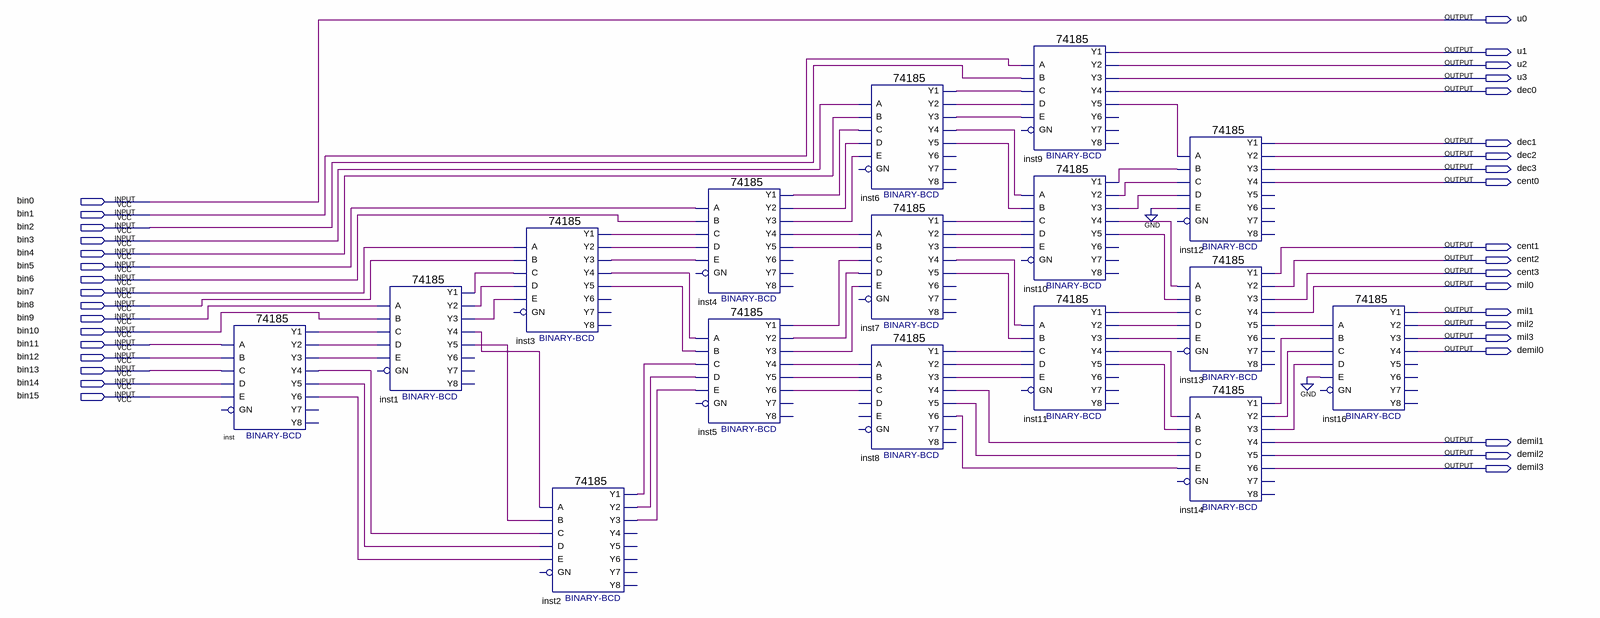
[diagram p0: schematic sheet]
// Quartus schematic BINARY2BCD.bdf as structural Verilog: 16 symbols, 36 pins
module BINARY2BCD (
  input  bin0,
  input  bin1,
  input  bin2,
  input  bin3,
  input  bin4,
  input  bin5,
  input  bin6,
  input  bin7,
  input  bin8,
  input  bin9,
  input  bin10,
  input  bin11,
  input  bin12,
  input  bin13,
  input  bin14,
  input  bin15,
  output u0,
  output u1,
  output u2,
  output u3,
  output dec0,
  output dec1,
  output dec2,
  output dec3,
  output cent0,
  output cent1,
  output cent2,
  output cent3,
  output mil0,
  output mil1,
  output mil2,
  output mil3,
  output demil0,
  output demil1,
  output demil2,
  output demil3
);

  wire inst1_y1, inst1_y2, inst1_y3, inst1_y4, inst1_y5, inst2_y1, inst2_y2, inst2_y3, inst3_y1, inst3_y2,
       inst3_y3, inst3_y4, inst3_y5, inst4_y1, inst4_y2, inst4_y3, inst4_y4, inst4_y5, inst5_y1, inst5_y2,
       inst5_y3, inst5_y4, inst5_y5, inst5_y6, inst6_y1, inst6_y2, inst6_y3, inst6_y4, inst6_y5, inst7_y1,
       inst7_y2, inst7_y3, inst7_y4, inst7_y5, inst8_y1, inst8_y2, inst8_y3, inst8_y4, inst8_y5, inst8_y6,
       inst9_y5, inst10_y1, inst10_y2, inst10_y3, inst10_y4, inst10_y5, inst11_y1, inst11_y2, inst11_y3,
       inst11_y4, inst11_y5, inst13_y5, inst14_y1, inst14_y2, inst14_y3, inst_y1, inst_y2, inst_y3, inst_y4,
       inst_y5, inst_y6;

  \74185  inst (
    .A(bin11), .B(bin12), .D(bin14), .C(bin13), .E(bin15), .Y1(inst_y1), .Y3(inst_y3), .Y2(inst_y2),
    .Y5(inst_y5), .Y4(inst_y4), .Y6(inst_y6));  // open: GN, Y8, Y7
  \74185  inst1 (
    .A(bin9), .B(bin10), .D(inst_y2), .C(inst_y1), .E(inst_y3), .Y1(inst1_y1), .Y3(inst1_y3), .Y2(inst1_y2),
    .Y5(inst1_y5), .Y4(inst1_y4));  // open: GN, Y6, Y8, Y7
  \74185  inst3 (
    .A(bin7), .B(bin8), .D(inst1_y2), .C(inst1_y1), .E(inst1_y3), .Y1(inst3_y1), .Y3(inst3_y3),
    .Y2(inst3_y2), .Y5(inst3_y5), .Y4(inst3_y4));  // open: GN, Y6, Y8, Y7
  \74185  inst2 (
    .A(inst1_y4), .B(inst1_y5), .D(inst_y5), .C(inst_y4), .E(inst_y6), .Y1(inst2_y1), .Y3(inst2_y3),
    .Y2(inst2_y2));  // open: GN, Y5, Y4, Y6, Y8, Y7
  \74185  inst4 (
    .A(bin5), .B(bin6), .D(inst3_y2), .C(inst3_y1), .E(inst3_y3), .Y1(inst4_y1), .Y3(inst4_y3),
    .Y2(inst4_y2), .Y5(inst4_y5), .Y4(inst4_y4));  // open: GN, Y6, Y8, Y7
  \74185  inst5 (
    .A(inst3_y4), .B(inst3_y5), .D(inst2_y2), .C(inst2_y1), .E(inst2_y3), .Y1(inst5_y1), .Y3(inst5_y3),
    .Y2(inst5_y2), .Y5(inst5_y5), .Y4(inst5_y4), .Y6(inst5_y6));  // open: GN, Y8, Y7
  \74185  inst6 (
    .A(bin3), .B(bin4), .D(inst4_y2), .C(inst4_y1), .E(inst4_y3), .Y1(inst6_y1), .Y3(inst6_y3),
    .Y2(inst6_y2), .Y5(inst6_y5), .Y4(inst6_y4));  // open: GN, Y6, Y8, Y7
  \74185  inst7 (
    .A(inst4_y4), .B(inst4_y5), .D(inst5_y2), .C(inst5_y1), .E(inst5_y3), .Y1(inst7_y1), .Y3(inst7_y3),
    .Y2(inst7_y2), .Y5(inst7_y5), .Y4(inst7_y4));  // open: GN, Y6, Y8, Y7
  \74185  inst8 (
    .A(inst5_y4), .B(inst5_y5), .C(inst5_y6), .Y1(inst8_y1), .Y3(inst8_y3), .Y2(inst8_y2), .Y5(inst8_y5),
    .Y4(inst8_y4), .Y6(inst8_y6));  // open: D, E, GN, Y8, Y7
  \74185  inst9 (
    .A(bin1), .B(bin2), .D(inst6_y2), .C(inst6_y1), .E(inst6_y3), .Y1(u1), .Y3(u3), .Y2(u2), .Y5(inst9_y5),
    .Y4(dec0));  // open: GN, Y6, Y8, Y7
  \74185  inst10 (
    .A(inst6_y4), .B(inst6_y5), .D(inst7_y2), .C(inst7_y1), .E(inst7_y3), .Y1(inst10_y1), .Y3(inst10_y3),
    .Y2(inst10_y2), .Y5(inst10_y5), .Y4(inst10_y4));  // open: GN, Y6, Y8, Y7
  \74185  inst11 (
    .A(inst7_y4), .B(inst7_y5), .D(inst8_y2), .C(inst8_y1), .E(inst8_y3), .Y1(inst11_y1), .Y3(inst11_y3),
    .Y2(inst11_y2), .Y5(inst11_y5), .Y4(inst11_y4));  // open: GN, Y6, Y8, Y7
  \74185  inst12 (
    .A(inst9_y5), .B(inst10_y1), .D(inst10_y3), .C(inst10_y2), .E(1'b0), .Y1(dec1), .Y3(dec3), .Y2(dec2),
    .Y4(cent0));  // open: GN, Y5, Y6, Y8, Y7
  \74185  inst13 (
    .A(inst10_y4), .B(inst10_y5), .D(inst11_y2), .C(inst11_y1), .E(inst11_y3), .Y1(cent1), .Y3(cent3),
    .Y2(cent2), .Y5(inst13_y5), .Y4(mil0));  // open: GN, Y6, Y8, Y7
  \74185  inst14 (
    .A(inst11_y4), .B(inst11_y5), .D(inst8_y5), .C(inst8_y4), .E(inst8_y6), .Y1(inst14_y1), .Y3(inst14_y3),
    .Y2(inst14_y2), .Y5(demil2), .Y4(demil1), .Y6(demil3));  // open: GN, Y8, Y7
  \74185  inst16 (
    .A(inst13_y5), .B(inst14_y1), .D(inst14_y3), .C(inst14_y2), .E(1'b0), .Y1(mil1), .Y3(mil3), .Y2(mil2),
    .Y4(demil0));  // open: GN, Y5, Y6, Y8, Y7

  assign u0 = bin0;
endmodule
